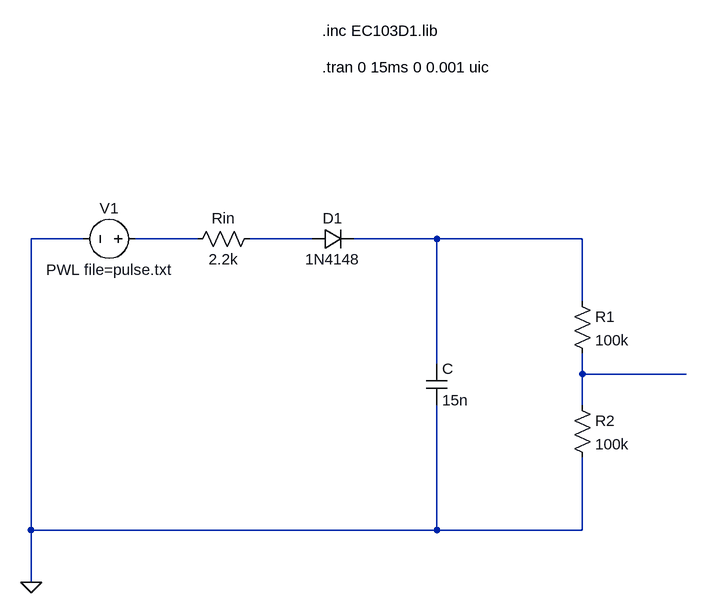
[diagram p0: schematic real-rc.asc]
real-rc.asc, the LTspice schematic file:
Version 4
SHEET 1 3836 760
WIRE 144 128 64 128
WIRE 320 128 224 128
WIRE 496 128 400 128
WIRE 688 128 560 128
WIRE 912 128 688 128
WIRE 912 224 912 128
WIRE 688 320 688 128
WIRE 912 336 912 304
WIRE 1072 336 912 336
WIRE 912 384 912 336
WIRE 64 576 64 128
WIRE 688 576 688 384
WIRE 688 576 64 576
WIRE 912 576 912 464
WIRE 912 576 688 576
WIRE 64 656 64 576
FLAG 64 656 0
SYMBOL res 416 112 R90
WINDOW 0 0 56 VBottom 2
WINDOW 3 32 56 VTop 2
SYMATTR InstName Rin
SYMATTR Value 2.2k
SYMATTR SpiceLine tol=1 pwr=0.1
SYMBOL cap 672 320 R0
SYMATTR InstName C
SYMATTR Value 15n
SYMBOL voltage 240 128 M270
WINDOW 0 32 56 VTop 2
WINDOW 3 -32 56 VBottom 2
WINDOW 123 0 0 Left 0
WINDOW 39 0 0 Left 0
SYMATTR InstName V1
SYMATTR Value PWL file=pulse.txt
SYMBOL res 896 208 R0
SYMATTR InstName R1
SYMATTR Value 100k
SYMBOL diode 496 112 M90
WINDOW 0 0 32 VBottom 2
WINDOW 3 32 32 VTop 2
SYMATTR InstName D1
SYMATTR Value 1N4148
SYMBOL res 896 368 R0
SYMATTR InstName R2
SYMATTR Value 100k
TEXT 512 -192 Left 2 !.inc EC103D1.lib
TEXT 512 -136 Left 2 !.tran 0 15ms 0 0.001 uic

The netlist it stands for:
* real-rc.asc
Rin N002 N001 2.2k tol=1 pwr=0.1
C N003 0 15n
V1 N001 0 PWL file=pulse.txt
R1 N003 N004 100k
D1 N002 N003 1N4148
R2 N004 0 100k
.model D D
.lib standard.dio
.inc EC103D1.lib
.tran 0 15ms 0 0.001 uic
.backanno
.end